# Altium schematic sheet Sheet1.SchDoc
size A1
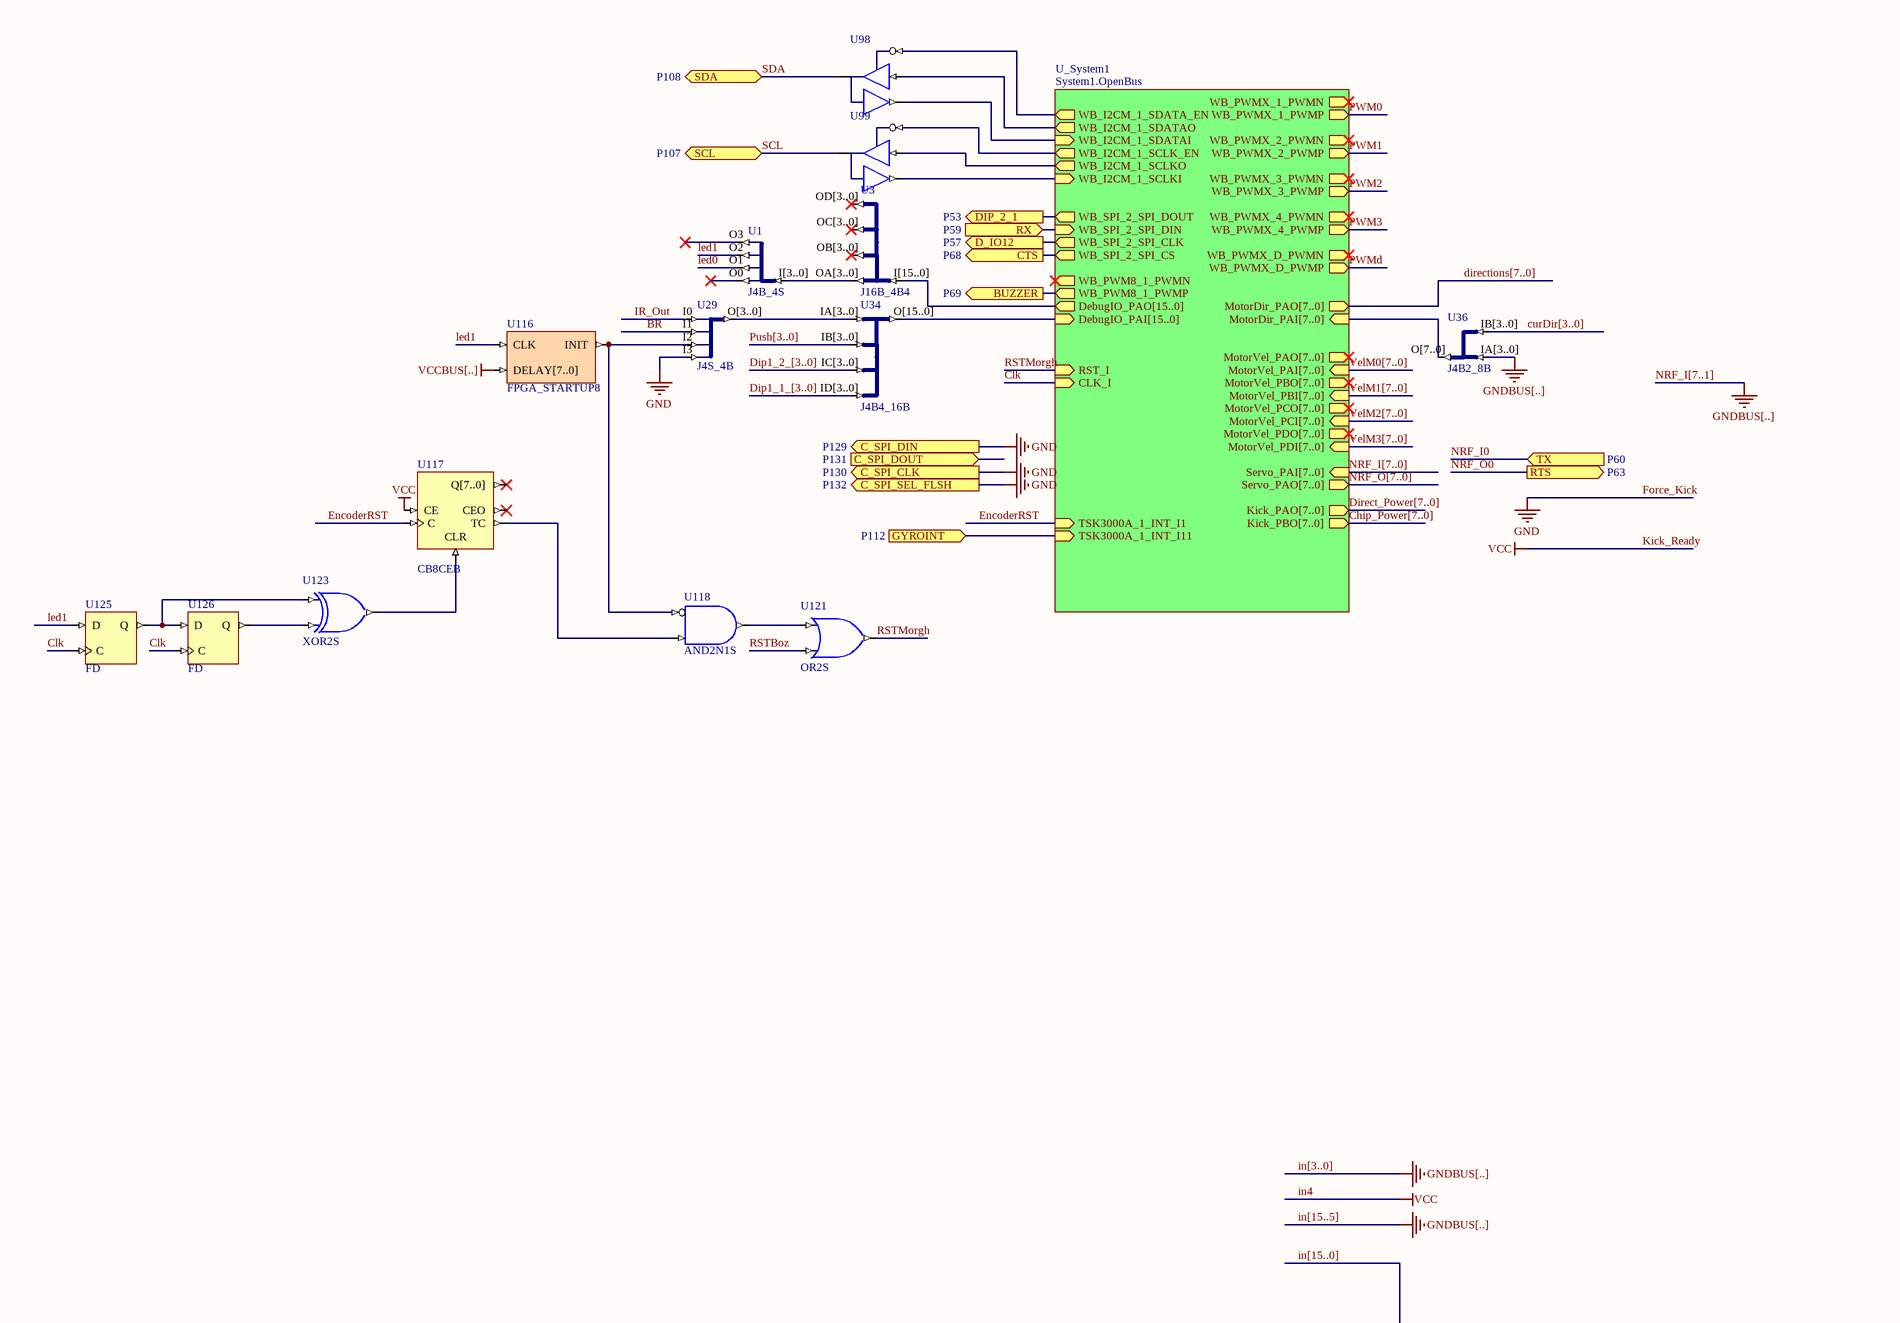
[diagram p0: Sheet1.SchDoc, top left]
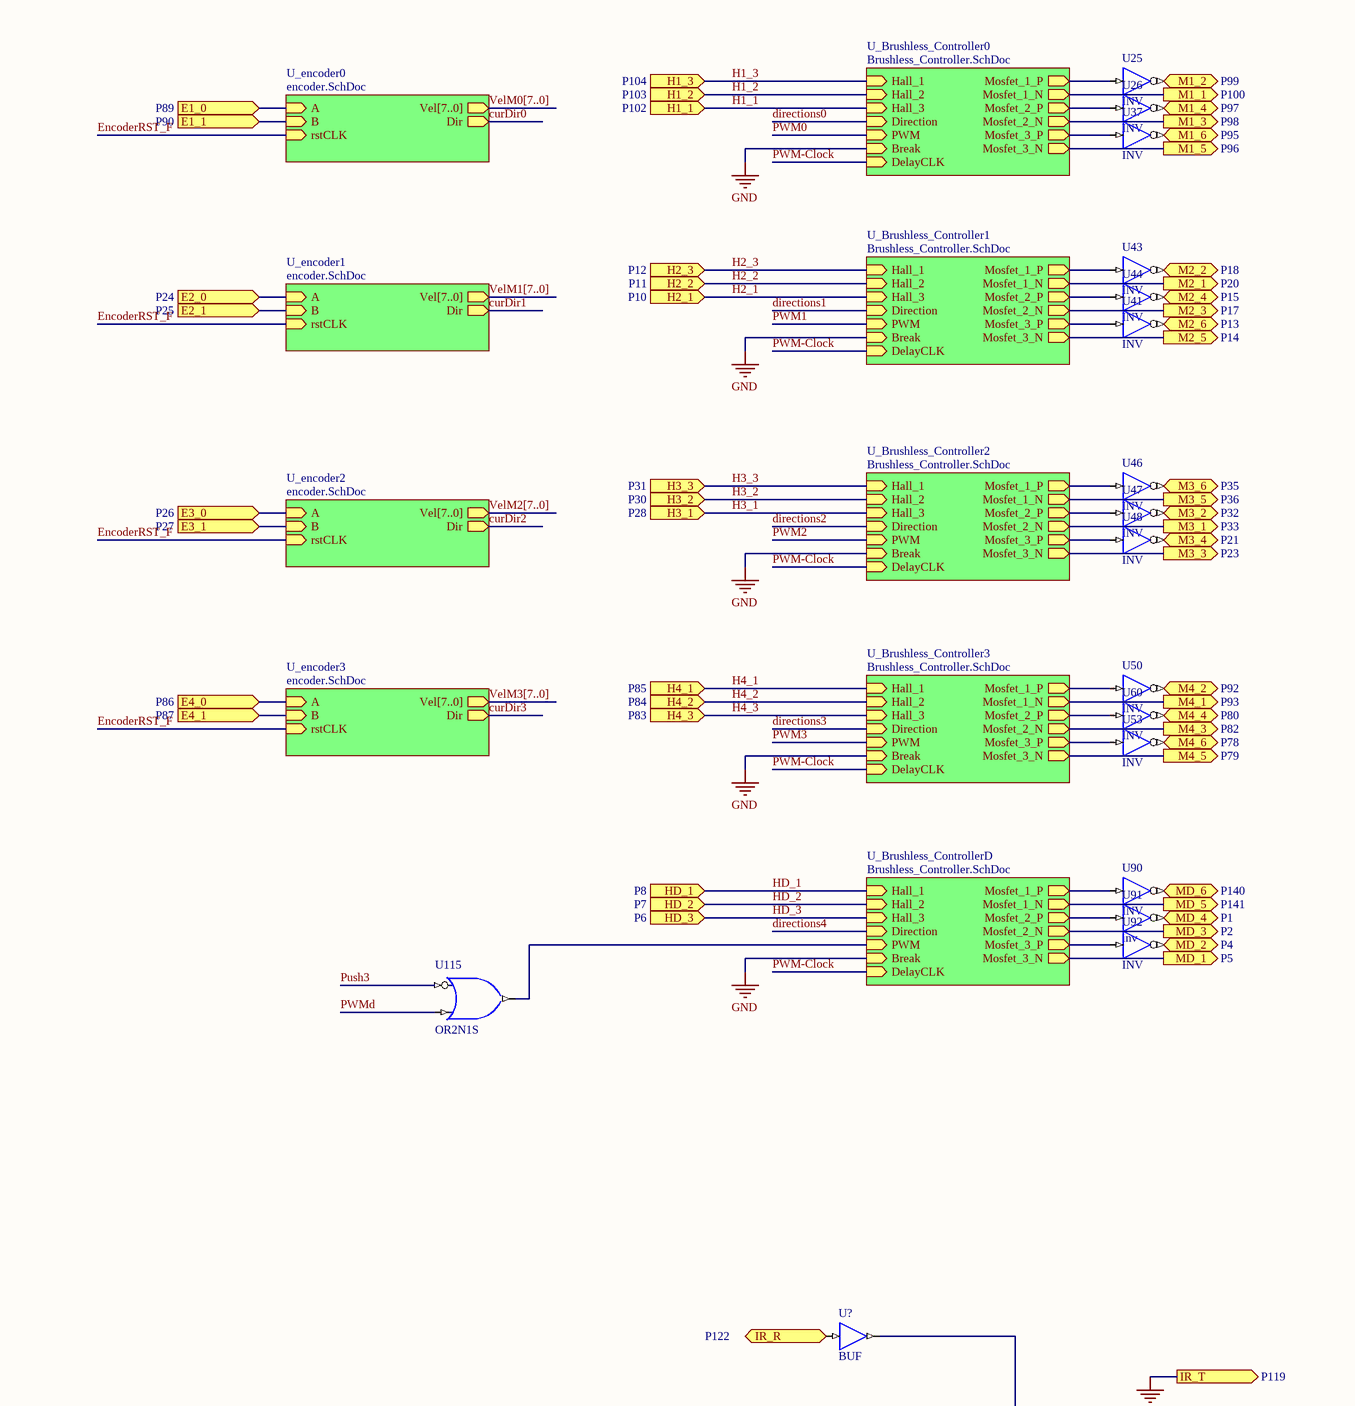
[diagram p1: Sheet1.SchDoc, top right]
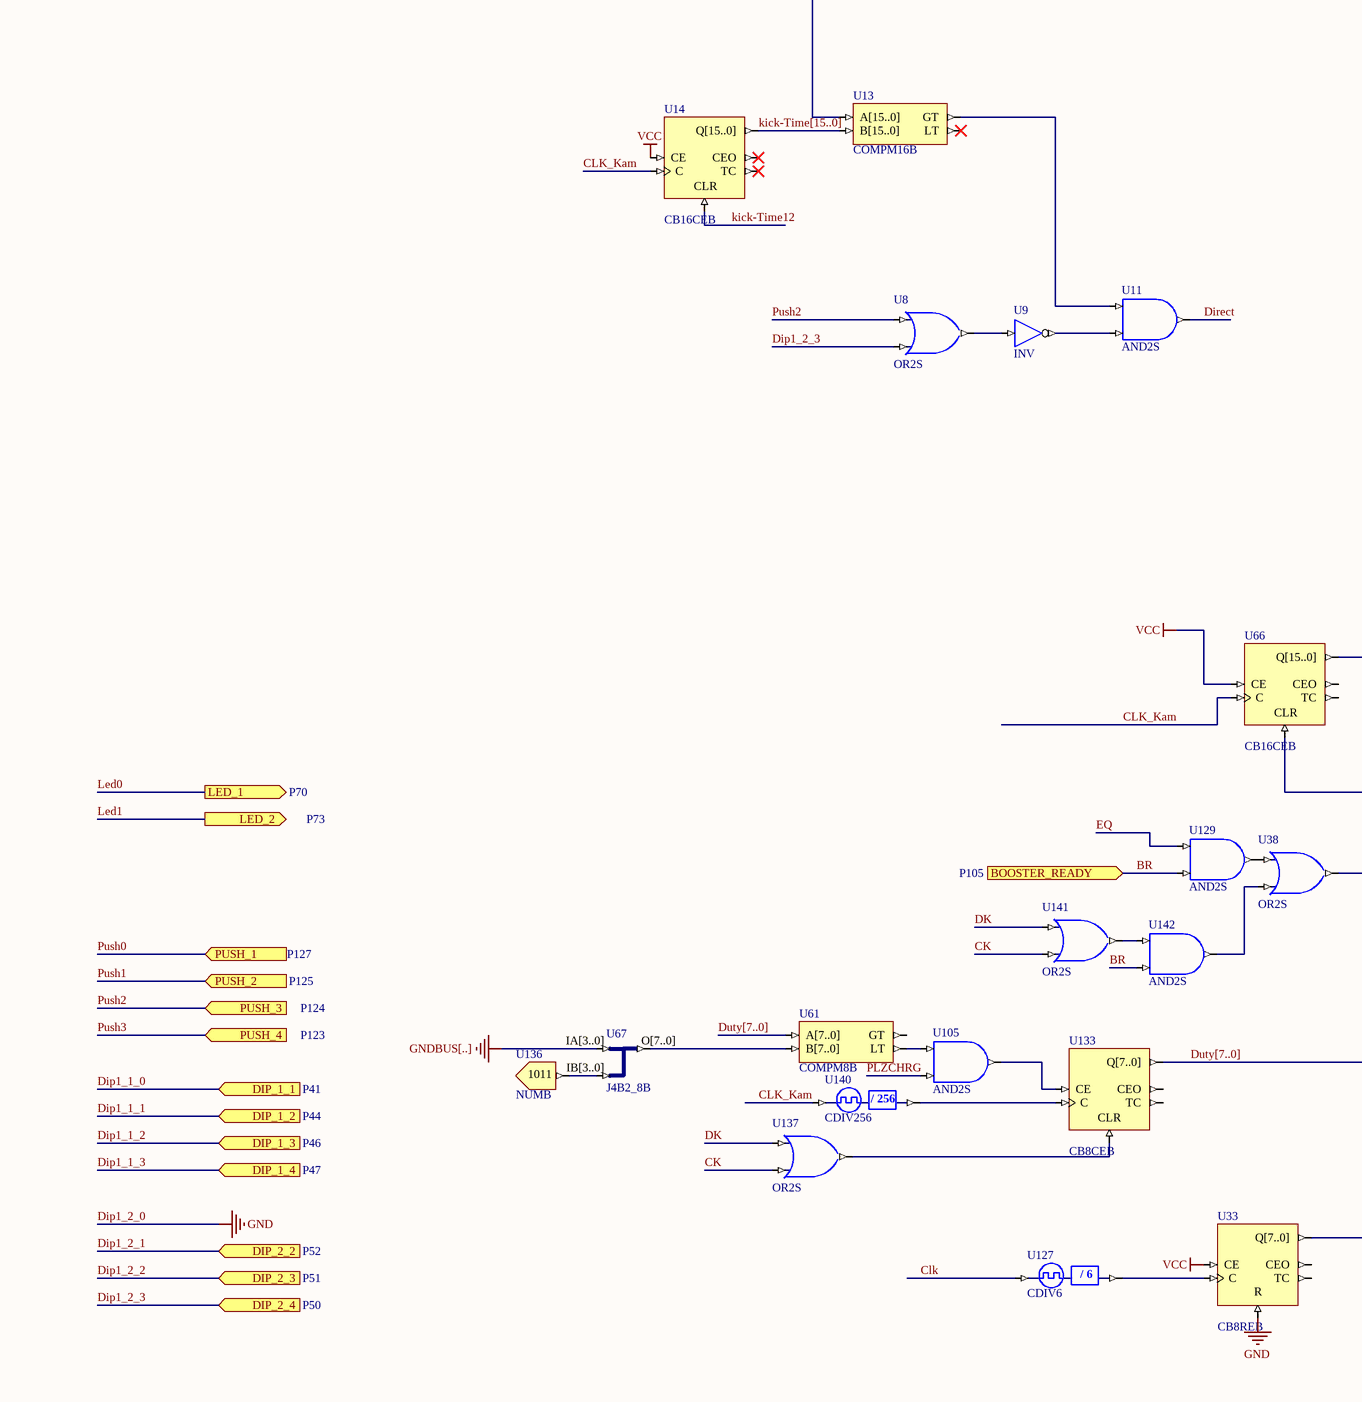
[diagram p2: Sheet1.SchDoc, bottom left]
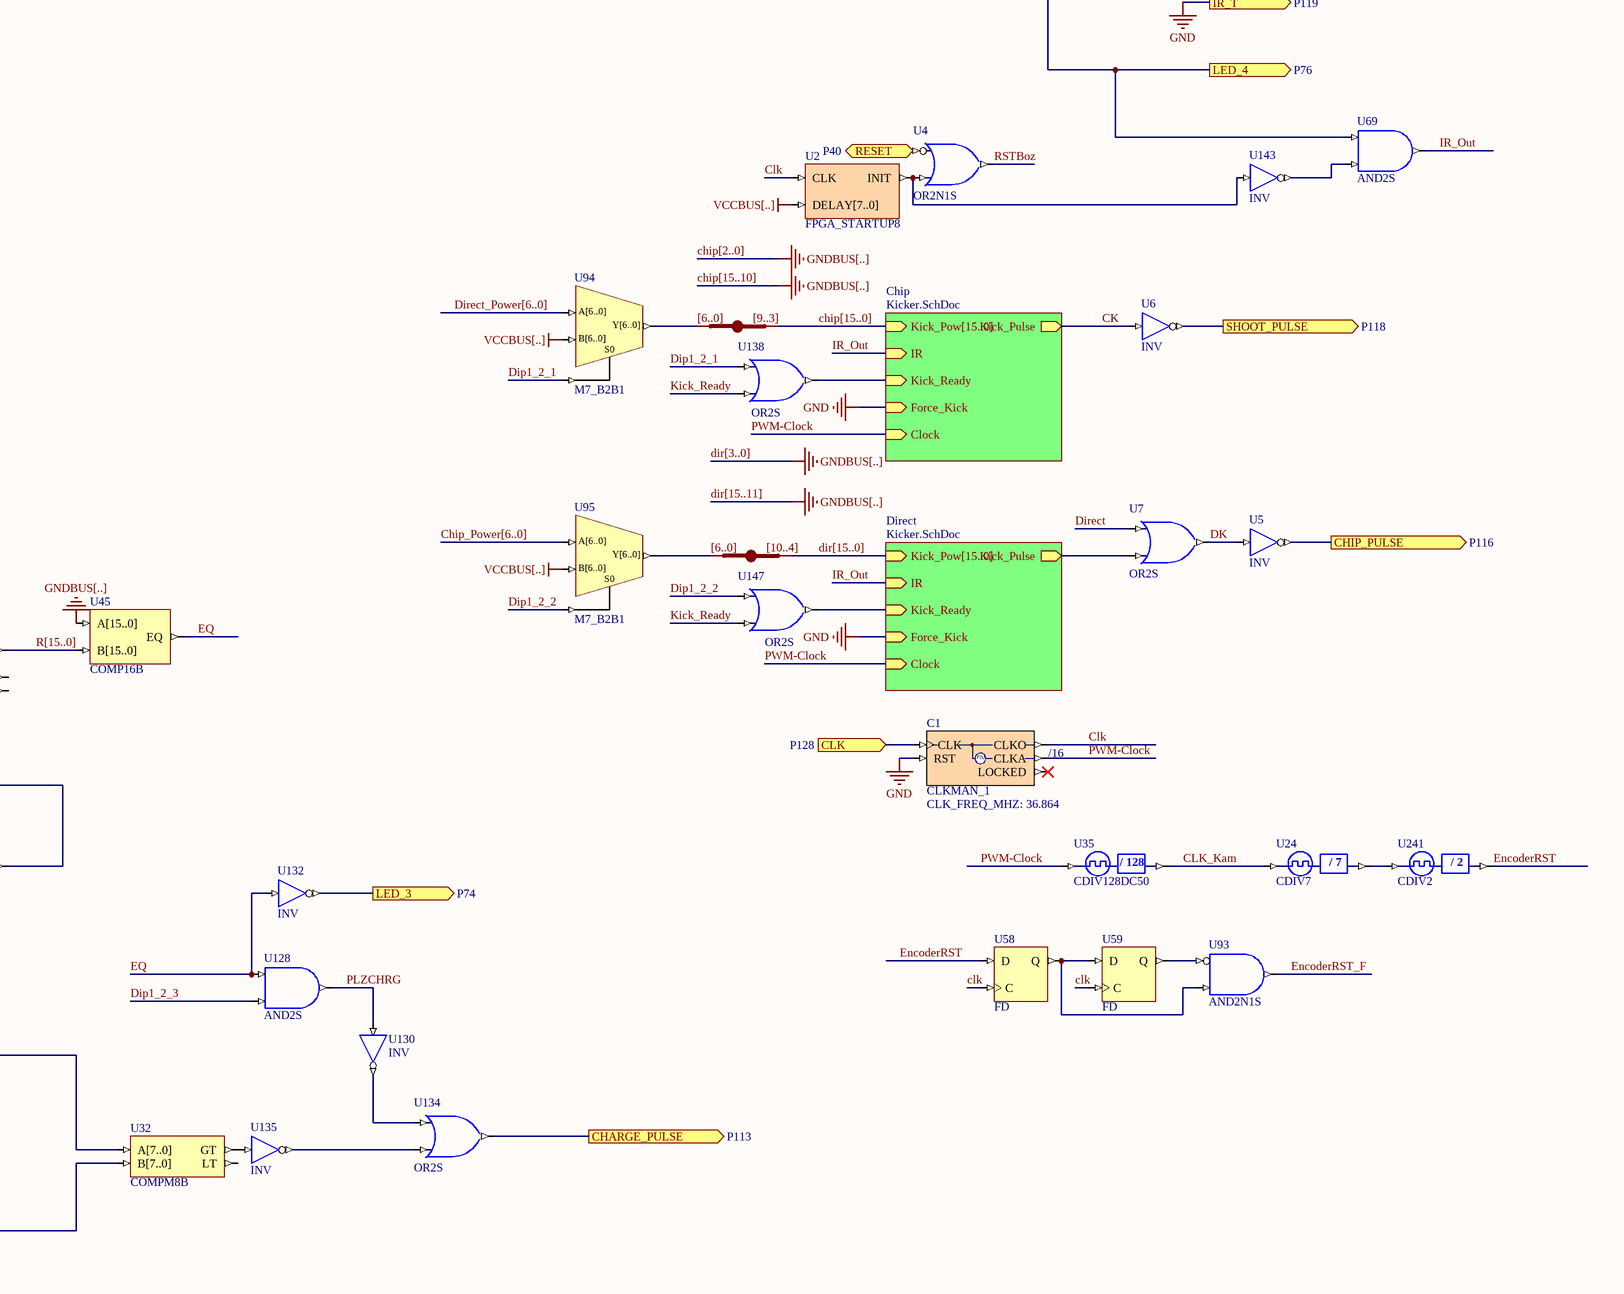
[diagram p3: Sheet1.SchDoc, bottom right]

## Parts
(Parts that share a designator on the sheet are numbered #1, #2 ... from top to bottom, then left to right.)
C1  CLKMAN_1  CLK_FREQ_MHZ: 36.864  ClkA_Operation: /16
JB_AUTO?#1  IndexA: [6..0]  IndexB: [9..3]  (hidden comment: JB)
JB_AUTO?#2  IndexA: [6..0]  IndexB: [10..4]  (hidden comment: JB)
U1  J4B_4S
U2  FPGA_STARTUP8
U3  J16B_4B4
U4  OR2N1S
U5  INV
U6  INV
U7  OR2S
U8  OR2S
U9  INV
U11  AND2S
U13  COMPM16B
U14  CB16CEB
U24  CDIV7
U25  INV
U26  INV
U29  J4S_4B
U32  COMPM8B
U33  CB8REB
U34  J4B4_16B
U35  CDIV128DC50
U36  J4B2_8B
U37  INV
U38  OR2S
U41  INV
U43  INV
U44  INV
U45  COMP16B
U46  INV
U47  INV
U48  INV
U50  INV
U53  INV
U58  FD
U59  FD
U60  INV
U61  COMPM8B
U66  CB16CEB
U67  J4B2_8B
U69  AND2S
U90  INV
U91  inv
U92  INV
U93  AND2N1S
U94  M7_B2B1
U95  M7_B2B1
U98  IOBUF  (value not drawn)
U99  IOBUF  (value not drawn)
U105  AND2S
U115  OR2N1S
U116  FPGA_STARTUP8
U117  CB8CEB
U118  AND2N1S
U121  OR2S
U123  XOR2S
U125  FD
U126  FD
U127  CDIV6
U128  AND2S
U129  AND2S
U130  INV
U132  INV
U133  CB8CEB
U134  OR2S
U135  INV
U136  NUMB
U137  OR2S
U138  OR2S
U140  CDIV256
U141  OR2S
U142  AND2S
U143  INV
U147  OR2S
U241  CDIV2
U?  BUF

## Sub-sheets
Chip = Kicker.SchDoc: Kick_Pow[15..0] (in), IR (in), Kick_Ready (in), Force_Kick (in), Clock (in), Kick_Pulse (out)
Direct = Kicker.SchDoc: Kick_Pow[15..0] (in), IR (in), Kick_Ready (in), Force_Kick (in), Clock (in), Kick_Pulse (out)
U_Brushless_Controller0 = Brushless_Controller.SchDoc: Hall_1 (in), Hall_2 (in), Hall_3 (in), Direction (in), PWM (in), Mosfet_1_P (out), Mosfet_1_N (out), Mosfet_2_P (out), Mosfet_2_N (out), Mosfet_3_P (out), Mosfet_3_N (out), Break (in), DelayCLK (in)
U_Brushless_Controller1 = Brushless_Controller.SchDoc: Hall_1 (in), Hall_2 (in), Hall_3 (in), Direction (in), PWM (in), Mosfet_1_P (out), Mosfet_1_N (out), Mosfet_2_P (out), Mosfet_2_N (out), Mosfet_3_P (out), Mosfet_3_N (out), Break (in), DelayCLK (in)
U_Brushless_Controller2 = Brushless_Controller.SchDoc: Hall_1 (in), Hall_2 (in), Hall_3 (in), Direction (in), PWM (in), Mosfet_1_P (out), Mosfet_1_N (out), Mosfet_2_P (out), Mosfet_2_N (out), Mosfet_3_P (out), Mosfet_3_N (out), Break (in), DelayCLK (in)
U_Brushless_Controller3 = Brushless_Controller.SchDoc: Hall_1 (in), Hall_2 (in), Hall_3 (in), Direction (in), PWM (in), Mosfet_1_P (out), Mosfet_1_N (out), Mosfet_2_P (out), Mosfet_2_N (out), Mosfet_3_P (out), Mosfet_3_N (out), Break (in), DelayCLK (in)
U_Brushless_ControllerD = Brushless_Controller.SchDoc: Hall_1 (in), Hall_2 (in), Hall_3 (in), Direction (in), PWM (in), Mosfet_1_P (out), Mosfet_1_N (out), Mosfet_2_P (out), Mosfet_2_N (out), Mosfet_3_P (out), Mosfet_3_N (out), Break (in), DelayCLK (in)
U_encoder0 = encoder.SchDoc: A (in), B (in), Vel[7..0] (out), Dir (out), rstCLK (in)
U_encoder1 = encoder.SchDoc: A (in), B (in), Vel[7..0] (out), Dir (out), rstCLK (in)
U_encoder2 = encoder.SchDoc: A (in), B (in), Vel[7..0] (out), Dir (out), rstCLK (in)
U_encoder3 = encoder.SchDoc: A (in), B (in), Vel[7..0] (out), Dir (out), rstCLK (in)
U_System1 = System1.OpenBus: MotorVel_PAO[7..0] (out), MotorVel_PAI[7..0] (in), MotorVel_PBO[7..0] (out), MotorVel_PBI[7..0] (in), MotorVel_PCO[7..0] (out), MotorVel_PCI[7..0] (in), MotorVel_PDO[7..0] (out), MotorVel_PDI[7..0] (in), WB_PWMX_1_PWMN (out), WB_PWMX_1_PWMP (out), WB_PWMX_2_PWMN (out), WB_PWMX_2_PWMP (out), WB_PWMX_3_PWMN (out), WB_PWMX_3_PWMP (out), WB_PWMX_4_PWMN (out), WB_PWMX_4_PWMP (out), DebugIO_PAO[15..0] (out), RST_I (in), CLK_I (in), DebugIO_PAI[15..0] (in), Kick_PAO[7..0] (out), Kick_PBO[7..0] (out), MotorDir_PAO[7..0] (out), Servo_PAO[7..0] (out), MotorDir_PAI[7..0] (in), WB_PWMX_D_PWMN (out), WB_PWMX_D_PWMP (out), TSK3000A_1_INT_I1 (in), WB_I2CM_1_SDATA_EN (out), WB_I2CM_1_SDATAO (out), WB_I2CM_1_SDATAI (in), WB_I2CM_1_SCLK_EN (out), WB_I2CM_1_SCLKO (out), WB_I2CM_1_SCLKI (in), TSK3000A_1_INT_I11 (in), WB_SPI_2_SPI_DOUT (out), WB_SPI_2_SPI_DIN (in), WB_SPI_2_SPI_CLK (out), WB_SPI_2_SPI_CS (out), Servo_PAI[7..0] (in), WB_PWM8_1_PWMN (out), WB_PWM8_1_PWMP (out)

## Ports
BOOSTER_READY (in, see P105), BUZZER (out, see P69), C_SPI_CLK (out, see P130), C_SPI_DIN (out, see P129), C_SPI_DOUT (in, see P131), C_SPI_SEL_FLSH (out, see P132), CHARGE_PULSE (out, see P113), CHIP_PULSE (out, see P116), CLK (in, see P128), CTS (out, see P68), D_IO12 (out, see P57), DIP_1_1 (in, see P41), DIP_1_2 (in, see P44), DIP_1_3 (in, see P46), DIP_1_4 (in, see P47), DIP_2_1 (out, see P53), DIP_2_2 (in, see P52), DIP_2_3 (in, see P51), DIP_2_4 (in, see P50), E1_0 (in, see P89), E1_1 (in, see P90), E2_0 (in, see P24), E2_1 (in, see P25), E3_0 (in, see P26), E3_1 (in, see P27), E4_0 (in, see P86), E4_1 (in, see P87), GYROINT (in, see P112), H1_1 (in, see P102), H1_2 (in, see P103), H1_3 (in, see P104), H2_1 (in, see P10), H2_2 (in, see P11), H2_3 (in, see P12), H3_1 (in, see P28), H3_2 (in, see P30), H3_3 (in, see P31), H4_1 (in, see P85), H4_2 (in, see P84), H4_3 (in, see P83), HD_1 (in, see P8), HD_2 (in, see P7), HD_3 (in, see P6), IR_R (in, see P122), IR_T (out, see P119), LED_1 (out, see P70), LED_2 (out, see P73), LED_3 (out, see P74), LED_4 (out, see P76), M1_1 (out, see P100), M1_2 (out, see P99), M1_3 (out, see P98), M1_4 (out, see P97), M1_5 (out, see P96), M1_6 (out, see P95), M2_1 (out, see P20), M2_2 (out, see P18), M2_3 (out, see P17), M2_4 (out, see P15), M2_5 (out, see P14), M2_6 (out, see P13), M3_1 (out, see P33), M3_2 (out, see P32), M3_3 (out, see P23), M3_4 (out, see P21), M3_5 (out, see P36), M3_6 (out, see P35), M4_1 (out, see P93), M4_2 (out, see P92), M4_3 (out, see P82), M4_4 (out, see P80), M4_5 (out, see P79), M4_6 (out, see P78), MD_1 (out, see P5), MD_2 (out, see P4), MD_3 (out, see P2), MD_4 (out, see P1), MD_5 (out, see P141), MD_6 (out, see P140), PUSH_1 (in, see P127), PUSH_2 (in, see P125), PUSH_3 (in, see P124), PUSH_4 (in, see P123), RESET (in, see P40), RTS (out, see P63), RX (in, see P59), SCL (bidir, see P107), SDA (bidir, see P108), SHOOT_PULSE (out, see P118), TX (in, see P60)

## Nets
chip[15..10]: U36.IA[3..0] U45.A[15..0] U67.IA[3..0]  [also labelled chip[2..0], dir[15..11], dir[3..0], GNDBUS[..], in[15..5], in[3..0], NRF_I[7..1]]
Dip1_2_0: C1.RST U29.I3 U33.R ; port IR_T, port C_SPI_DIN, port C_SPI_CLK, port C_SPI_SEL_FLSH, sheet U_Brushless_Controller0/Break, sheet U_Brushless_Controller1/Break, sheet U_Brushless_Controller2/Break, sheet U_Brushless_Controller3/Break, sheet U_Brushless_ControllerD/Break, sheet Chip/Force_Kick, sheet Direct/Force_Kick  [also labelled Force_Kick, GND]
in4: U14.CE U33.CE U66.CE U117.CE U138.I1 U147.I1  [also labelled Kick_Ready, VCC]
VCCBUS[..]: U2.DELAY[7..0] U94.B[6..0] U95.B[6..0] U116.DELAY[7..0]
BR: U29.I1 U129.I1 U142.I1 ; port BOOSTER_READY
BUZZER: port BUZZER, sheet U_System1/WB_PWM8_1_PWMP
CHARGE_PULSE: U134.O ; port CHARGE_PULSE
chip[15..0]: JB_AUTO?#1.B[0..0] ; sheet Chip/Kick_Pow[15..0]
Chip_Power[6..0]: U95.A[6..0]
CHIP_PULSE: U5.O ; port CHIP_PULSE
CK: U6.I U137.I1 U141.I1 ; sheet Chip/Kick_Pulse
Clk: C1.CLKO U2.CLK U58.C U59.C U125.C U126.C U127.CLKIN ; sheet U_System1/CLK_I
CLK: C1.CLK ; port CLK  [a separate net that carries the same name]
CLK_Kam: U14.C U24.CLKIN U35.CLKDV U66.C U140.CLKIN
CTS: port CTS, sheet U_System1/WB_SPI_2_SPI_CS
curDir0: sheet U_encoder0/Dir
curDir1: sheet U_encoder1/Dir
curDir2: sheet U_encoder2/Dir
curDir3: sheet U_encoder3/Dir
curDir[3..0]: U36.IB[3..0]
D_IO12: port D_IO12, sheet U_System1/WB_SPI_2_SPI_CLK
Dip1_1_0: port DIP_1_1
Dip1_1_1: port DIP_1_2
Dip1_1_2: port DIP_1_3
Dip1_1_3: port DIP_1_4
Dip1_1_[3..0]: U34.ID[3..0]
Dip1_2_1: U94.S0 U138.I0 ; port DIP_2_2
Dip1_2_2: U95.S0 U147.I0 ; port DIP_2_3
Dip1_2_3: U8.I1 U128.I1 ; port DIP_2_4
Dip1_2_[3..0]: U34.IC[3..0]
DIP_2_1: port DIP_2_1, sheet U_System1/WB_SPI_2_SPI_DOUT
dir[15..0]: JB_AUTO?#2.B[0..0] ; sheet Direct/Kick_Pow[15..0]
Direct: U7.I0 U11.O
Direct_Power[6..0]: U94.A[6..0]
directions0: sheet U_Brushless_Controller0/Direction
directions1: sheet U_Brushless_Controller1/Direction
directions2: sheet U_Brushless_Controller2/Direction
directions3: sheet U_Brushless_Controller3/Direction
directions4: sheet U_Brushless_ControllerD/Direction
DK: U5.I U7.O U137.I0 U141.I0
Duty[7..0]: U32.A[7..0] U61.A[7..0] U133.Q[7..0]
E1_0: port E1_0, sheet U_encoder0/A
E1_1: port E1_1, sheet U_encoder0/B
E2_0: port E2_0, sheet U_encoder1/A
E2_1: port E2_1, sheet U_encoder1/B
E3_0: port E3_0, sheet U_encoder2/A
E3_1: port E3_1, sheet U_encoder2/B
E4_0: port E4_0, sheet U_encoder3/A
E4_1: port E4_1, sheet U_encoder3/B
EncoderRST: U58.D U117.C U241.CLKDV ; sheet U_System1/TSK3000A_1_INT_I1
EncoderRST_F: U93.O ; sheet U_encoder2/rstCLK, sheet U_encoder1/rstCLK, sheet U_encoder0/rstCLK, sheet U_encoder3/rstCLK
EQ: U45.EQ U128.I0 U129.I0 U132.I
GYROINT: port GYROINT, sheet U_System1/TSK3000A_1_INT_I11
H1_1: port H1_1, sheet U_Brushless_Controller0/Hall_3
H1_2: port H1_2, sheet U_Brushless_Controller0/Hall_2
H1_3: port H1_3, sheet U_Brushless_Controller0/Hall_1
H2_1: port H2_1, sheet U_Brushless_Controller1/Hall_3
H2_2: port H2_2, sheet U_Brushless_Controller1/Hall_2
H2_3: port H2_3, sheet U_Brushless_Controller1/Hall_1
H3_1: port H3_1, sheet U_Brushless_Controller2/Hall_3
H3_2: port H3_2, sheet U_Brushless_Controller2/Hall_2
H3_3: port H3_3, sheet U_Brushless_Controller2/Hall_1
H4_1: port H4_1, sheet U_Brushless_Controller3/Hall_1
H4_2: port H4_2, sheet U_Brushless_Controller3/Hall_2
H4_3: port H4_3, sheet U_Brushless_Controller3/Hall_3
HD_1: port HD_1, sheet U_Brushless_ControllerD/Hall_1
HD_2: port HD_2, sheet U_Brushless_ControllerD/Hall_2
HD_3: port HD_3, sheet U_Brushless_ControllerD/Hall_3
in[15..0]: U13.A[15..0]
IR_Out: U29.I0 U69.O ; sheet Chip/IR, sheet Direct/IR
IR_R: U?.I ; port IR_R
kick-Time12: U14.CLR
kick-Time[15..0]: U13.B[15..0] U14.Q[15..0]
Led0: U1.O1 ; port LED_1
Led1: U1.O2 U116.CLK U125.D ; port LED_2
LED_3: U132.O ; port LED_3
LED_4: U69.I0 U?.O ; port LED_4
M1_1: port M1_1, sheet U_Brushless_Controller0/Mosfet_1_N
M1_2: U25.O ; port M1_2
M1_3: port M1_3, sheet U_Brushless_Controller0/Mosfet_2_N
M1_4: U26.O ; port M1_4
M1_5: port M1_5, sheet U_Brushless_Controller0/Mosfet_3_N
M1_6: U37.O ; port M1_6
M2_1: port M2_1, sheet U_Brushless_Controller1/Mosfet_1_N
M2_2: U43.O ; port M2_2
M2_3: port M2_3, sheet U_Brushless_Controller1/Mosfet_2_N
M2_4: U44.O ; port M2_4
M2_5: port M2_5, sheet U_Brushless_Controller1/Mosfet_3_N
M2_6: U41.O ; port M2_6
M3_1: port M3_1, sheet U_Brushless_Controller2/Mosfet_2_N
M3_2: U47.O ; port M3_2
M3_3: port M3_3, sheet U_Brushless_Controller2/Mosfet_3_N
M3_4: U48.O ; port M3_4
M3_5: port M3_5, sheet U_Brushless_Controller2/Mosfet_1_N
M3_6: U46.O ; port M3_6
M4_1: port M4_1, sheet U_Brushless_Controller3/Mosfet_1_N
M4_2: U50.O ; port M4_2
M4_3: port M4_3, sheet U_Brushless_Controller3/Mosfet_2_N
M4_4: U60.O ; port M4_4
M4_5: port M4_5, sheet U_Brushless_Controller3/Mosfet_3_N
M4_6: U53.O ; port M4_6
MD_1: port MD_1, sheet U_Brushless_ControllerD/Mosfet_3_N
MD_2: U92.O ; port MD_2
MD_3: port MD_3, sheet U_Brushless_ControllerD/Mosfet_2_N
MD_4: U91.O ; port MD_4
MD_5: port MD_5, sheet U_Brushless_ControllerD/Mosfet_1_N
MD_6: U90.O ; port MD_6
NRF_I0: port TX
NRF_O0: port RTS
PLZCHRG: U105.I1 U128.O U130.I
Push0: port PUSH_1
Push1: port PUSH_2
Push2: U8.I0 ; port PUSH_3
Push3: U115.I0 ; port PUSH_4
Push[3..0]: U34.IB[3..0]
PWM0: sheet U_System1/WB_PWMX_1_PWMP, sheet U_Brushless_Controller0/PWM
PWM1: sheet U_System1/WB_PWMX_2_PWMP, sheet U_Brushless_Controller1/PWM
PWM2: sheet U_System1/WB_PWMX_3_PWMP, sheet U_Brushless_Controller2/PWM
PWM3: sheet U_System1/WB_PWMX_4_PWMP, sheet U_Brushless_Controller3/PWM
PWM-Clock: C1.CLKA U35.CLKIN ; sheet U_Brushless_Controller0/DelayCLK, sheet U_Brushless_Controller1/DelayCLK, sheet U_Brushless_Controller2/DelayCLK, sheet U_Brushless_Controller3/DelayCLK, sheet U_Brushless_ControllerD/DelayCLK, sheet Chip/Clock, sheet Direct/Clock
PWMd: U115.I1 ; sheet U_System1/WB_PWMX_D_PWMP
R[15..0]: U45.B[15..0] U66.Q[15..0]
RESET: U4.I0 ; port RESET
RSTBoz: U4.O U121.I1
RSTMorgh: U121.O ; sheet U_System1/RST_I
RX: port RX, sheet U_System1/WB_SPI_2_SPI_DIN
SCL: U99.IO ; port SCL
SDA: U98.IO ; port SDA
SHOOT_PULSE: U6.O ; port SHOOT_PULSE
NetJB_AUTO?#1_A[0..0]: JB_AUTO?#1.A[0..0] U94.Y[6..0]
NetJB_AUTO?#2_A[0..0]: JB_AUTO?#2.A[0..0] U95.Y[6..0]
NetU1_I[3..0]: U1.I[3..0] U3.OA[3..0]
NetU2_INIT: U2.INIT U4.I1 U143.I
NetU3_I[15..0]: U3.I[15..0] ; sheet U_System1/DebugIO_PAO[15..0]
NetU7_I1: U7.I1 ; sheet Direct/Kick_Pulse
NetU8_O: U8.O U9.I
NetU9_O: U9.O U11.I1
NetU11_I0: U11.I0 U13.GT
NetU24_CLKDV: U24.CLKDV U241.CLKIN
NetU25_I: U25.I ; sheet U_Brushless_Controller0/Mosfet_1_P
NetU26_I: U26.I ; sheet U_Brushless_Controller0/Mosfet_2_P
NetU29_I2: U29.I2 U116.INIT U118.I0
NetU29_O[3..0]: U29.O[3..0] U34.IA[3..0]
NetU32_B[7..0]: U32.B[7..0] U33.Q[7..0]
NetU32_GT: U32.GT U135.I
NetU33_C: U33.C U127.CLKDV
NetU34_O[15..0]: U34.O[15..0] ; sheet U_System1/DebugIO_PAI[15..0]
NetU36_O[7..0]: U36.O[7..0] ; sheet U_System1/MotorDir_PAI[7..0]
NetU37_I: U37.I ; sheet U_Brushless_Controller0/Mosfet_3_P
NetU38_I0: U38.I0 U129.O
NetU38_I1: U38.I1 U142.O
NetU38_O: U38.O U66.CLR
NetU41_I: U41.I ; sheet U_Brushless_Controller1/Mosfet_3_P
NetU43_I: U43.I ; sheet U_Brushless_Controller1/Mosfet_1_P
NetU44_I: U44.I ; sheet U_Brushless_Controller1/Mosfet_2_P
NetU46_I: U46.I ; sheet U_Brushless_Controller2/Mosfet_1_P
NetU47_I: U47.I ; sheet U_Brushless_Controller2/Mosfet_2_P
NetU48_I: U48.I ; sheet U_Brushless_Controller2/Mosfet_3_P
NetU50_I: U50.I ; sheet U_Brushless_Controller3/Mosfet_1_P
NetU53_I: U53.I ; sheet U_Brushless_Controller3/Mosfet_3_P
NetU58_Q: U58.Q U59.D U93.I1
NetU59_Q: U59.Q U93.I0
NetU60_I: U60.I ; sheet U_Brushless_Controller3/Mosfet_2_P
NetU61_B[7..0]: U61.B[7..0] U67.O[7..0]
NetU61_LT: U61.LT U105.I0
NetU67_IB[3..0]: U67.IB[3..0] U136.O[3..0]
NetU69_I1: U69.I1 U143.O
NetU90_I: U90.I ; sheet U_Brushless_ControllerD/Mosfet_1_P
NetU91_I: U91.I ; sheet U_Brushless_ControllerD/Mosfet_2_P
NetU92_I: U92.I ; sheet U_Brushless_ControllerD/Mosfet_3_P
NetU98_I: U98.I ; sheet U_System1/WB_I2CM_1_SDATAO
NetU98_O: U98.O ; sheet U_System1/WB_I2CM_1_SDATAI
NetU98_T: U98.T ; sheet U_System1/WB_I2CM_1_SDATA_EN
NetU99_I: U99.I ; sheet U_System1/WB_I2CM_1_SCLKO
NetU99_O: U99.O ; sheet U_System1/WB_I2CM_1_SCLKI
NetU99_T: U99.T ; sheet U_System1/WB_I2CM_1_SCLK_EN
NetU105_O: U105.O U133.CE
NetU115_O: U115.O ; sheet U_Brushless_ControllerD/PWM
NetU117_CLR: U117.CLR U123.O
NetU117_TC: U117.TC U118.I1
NetU118_O: U118.O U121.I0
NetU123_I0: U123.I0 U125.Q U126.D
NetU123_I1: U123.I1 U126.Q
NetU130_O: U130.O U134.I0
NetU133_C: U133.C U140.CLKDV
NetU133_CLR: U133.CLR U137.O
NetU134_I1: U134.I1 U135.O
NetU138_O: U138.O ; sheet Chip/Kick_Ready
NetU141_O: U141.O U142.I0
NetU147_O: U147.O ; sheet Direct/Kick_Ready

Not connected (* = marked no-connect by the designer): C1 LOCKED*; U1 O0* O3*; U3 OB[3..0]* OC[3..0]* OD[3..0]*; U13 LT*; U14 CEO* TC*; U32 LT; U33 CEO TC; U61 GT; U66 CEO TC; U117 CEO* Q[7..0]*; U133 CEO TC

## Buses and harness runs
bus chip[2..0]
bus chip[15..0] = sheet Chip/Kick_Pow[15..0]
bus chip[15..10]
bus Chip_Power[6..0]
bus Chip_Power[7..0] = sheet U_System1/Kick_PBO[7..0]
bus curDir[3..0]
bus Dip1_1_[3..0]
bus Dip1_2_[3..0]
bus dir[3..0]
bus dir[15..0] = sheet Direct/Kick_Pow[15..0]
bus dir[15..11]
bus Direct_Power[6..0]
bus Direct_Power[7..0] = sheet U_System1/Kick_PAO[7..0]
bus directions[7..0] = sheet U_System1/MotorDir_PAO[7..0]
bus Duty[7..0]
bus in[3..0]
bus in[15..0]
bus in[15..5]
bus kick-Time[15..0]
bus NRF_I[7..0] = sheet U_System1/Servo_PAI[7..0]
bus NRF_I[7..1]
bus NRF_O[7..0] = sheet U_System1/Servo_PAO[7..0]
bus Push[3..0]
bus R[15..0]
bus VelM0[7..0] = sheet U_encoder0/Vel[7..0]
bus VelM0[7..0] = sheet U_System1/MotorVel_PAI[7..0]
bus VelM1[7..0] = sheet U_encoder1/Vel[7..0]
bus VelM1[7..0] = sheet U_System1/MotorVel_PBI[7..0]
bus VelM2[7..0] = sheet U_encoder2/Vel[7..0]
bus VelM2[7..0] = sheet U_System1/MotorVel_PCI[7..0]
bus VelM3[7..0] = sheet U_encoder3/Vel[7..0]
bus VelM3[7..0] = sheet U_System1/MotorVel_PDI[7..0]

## Notes on the sheet
- (in symbol CDIV2) / 2
- (in symbol CDIV6) / 6
- (in symbol CDIV7) / 7
- (in symbol CDIV128DC50) / 128
- (in symbol CDIV256) / 256
- (in symbol CLKMAN_1) F(x)
- (in symbol NUMB) 1011

## Library data of the parts
C1 = CLKMAN_1: Single Operational Output Clock Manager; Clk_Count: 1; Published: 5-Jul-2004; Publisher: Altium Limited; LastRevisionNo: 1.00.00; Nexus_Core: ClockManager; HelpURL: CR0118 FPGA Generic Library Guide.pdf#page=149; ComponentLink1URL: CR0128 FPGA Clock Manager Resource Usage.pdf#page=2; ComponentLink1Description: Core &Resource Usage; FunctionalClass: Clock Manager; PortSize: 1
JB_AUTO?#1 JB_AUTO?#2 = JB: System BUS Joiner; Published: 29-Jan-2004; Publisher: Altium Limited; LastRevisionNo: 1.00.00; HelpURL: CR0118 FPGA Generic Library Guide.pdf#page=297; FunctionalClass: Bus Joiner
U1 = J4B_4S: 4-Bit input bus to 4 Single pin outputs; FunctionalClass: Bus Joiner; PortSize: 4; ArchiveName: GENERIC; VHDLIB_SIM: GENERIC_LIB; Published: 29-Jan-2004; Publisher: Altium Limited; LastRevisionNo: 1.00.00; HelpURL: CR0118 FPGA Generic Library Guide.pdf#page=304; ComponentLink1URL: CR0126 FPGA Bus Joiner Resource Usage.pdf#page=11; ComponentLink1Description: Core &Resource Usage
U2 U116 = FPGA_STARTUP8: FPGA Startup With 8 Bit Delay; Published: 9-Dec-2004; Publisher: Altium Limited; HelpURL: CR0119 FPGA_STARTUPx Powerup Delay Unit.pdf; LastRevisionNo: 1.00.00; ComponentLink1Description: Core &Resource Usage; ComponentLink1URL: CR0139 FPGA Peripheral Resource Usage.pdf#page=11
U3 = J16B_4B4: 1 x 16-bit input bus to 4 x 4-Bit output bus; FunctionalClass: Bus Joiner; PortSize: 16; ArchiveName: GENERIC; VHDLIB_SIM: GENERIC_LIB; Published: 29-Jan-2004; Publisher: Altium Limited; LastRevisionNo: 1.00.00; HelpURL: CR0118 FPGA Generic Library Guide.pdf#page=298; ComponentLink1URL: CR0126 FPGA Bus Joiner Resource Usage.pdf#page=40; ComponentLink1Description: Core &Resource Usage
U4 U115 = OR2B1: 2-Input OR Gate with Active Low A Input, Single Pin Version; XilinxEquivalent: OR2B1; FunctionalClass: Logic Primitive; PortSize: 2; ArchiveName: GENERIC; VHDLIB_SIM: GENERIC_LIB; Published: 29-Jan-2004; Publisher: Altium Limited; LastRevisionNo: 1.00.00; HelpURL: CR0118 FPGA Generic Library Guide.pdf#page=410; ComponentLink1URL: CR0136 FPGA Logic Primitive Resource Usage.pdf#page=187; ComponentLink1Description: Core &Resource Usage; SubClass: OR; PortStyle: Single Pin Version
U5 U6 U9 U25 U26 U37 U41 U43 U44 U46-U48 U50 U53 U60 U90 U92 U130 U132 U135 U143 = INV: Inverter; FunctionalClass: Logic Primitive; ArchiveName: GENERIC; VHDLIB_SIM: GENERIC_LIB; Published: 29-Jan-2004; Publisher: Altium Limited; XilinxEquivalent: INV; LastRevisionNo: 1.00.00; HelpURL: CR0118 FPGA Generic Library Guide.pdf#page=291; ComponentLink1URL: CR0136 FPGA Logic Primitive Resource Usage.pdf#page=61; ComponentLink1Description: Core &Resource Usage; SubClass: INV
U7 U8 U38 U121 U134 U137 U138 U141 U147 = OR2: 2-Input OR Gate, Single Pin Version; XilinxEquivalent: OR2; FunctionalClass: Logic Primitive; PortSize: 2; ArchiveName: GENERIC; VHDLIB_SIM: GENERIC_LIB; Published: 29-Jan-2004; Publisher: Altium Limited; LastRevisionNo: 1.00.00; HelpURL: CR0118 FPGA Generic Library Guide.pdf#page=410; ComponentLink1URL: CR0136 FPGA Logic Primitive Resource Usage.pdf#page=190; ComponentLink1Description: Core &Resource Usage; SubClass: OR; PortStyle: Single Pin Version
U11 U69 U128 U129 U142 = AND2: 2-Input AND Gate, Single Pin Version; XilinxEquivalent: AND2; FunctionalClass: Logic Primitive; PortSize: 2; ArchiveName: GENERIC; VHDLIB_SIM: GENERIC_LIB; Published: 29-Jan-2004; Publisher: Altium Limited; LastRevisionNo: 1.00.00; HelpURL: CR0118 FPGA Generic Library Guide.pdf#page=114; ComponentLink1URL: CR0136 FPGA Logic Primitive Resource Usage.pdf#page=13; ComponentLink1Description: Core &Resource Usage; SubClass: AND; PortStyle: Single Pin Version
U13 = COMPM16B: 16-Bit Magnitude Comparator, Bus Version; SubClass: COMPM; PortSize: 16; ArchiveName: GENERIC; VHDLIB_SIM: GENERIC_LIB; Published: 29-Jan-2004; Publisher: Altium Limited; XilinxEquivalent: COMPM16; LastRevisionNo: 1.00.00; HelpURL: CR0118 FPGA Generic Library Guide.pdf#page=153; ComponentLink1URL: CR0129 FPGA Comparator Resource Usage.pdf#page=45; ComponentLink1Description: Core &Resource Usage; FunctionalClass: Comparator; PortStyle: Bus Version
U14 U66 = CB16CEB: 16-Bit Cascadable Binary Counters with Clock Enable and Asynchronous Clear, Bus Version; XilinxEquivalent: CB16CE; ClockTrigger: Rising; Enable: High; PortSize: 16; ArchiveName: GENERIC; VHDLIB_SIM: GENERIC_LIB; Published: 29-Jan-2004; Publisher: Altium Limited; LastRevisionNo: 1.00.00; HelpURL: CR0118 FPGA Generic Library Guide.pdf#page=128; ComponentLink1URL: CR0130 FPGA Counter Resource Usage.pdf#page=33; ComponentLink1Description: Core &Resource Usage; FunctionalClass: Counter; SubClass: Binary; Reset: Asynchronous; PortType: Bus Version
U24 = CDIV7: Clock Divider by 7; DivisorRate: 7; ArchiveName: GENERIC; VHDLIB_SIM: GENERIC_LIB; Published: 29-Jan-2004; Publisher: Altium Limited; LastRevisionNo: 1.00.00; HelpURL: CR0118 FPGA Generic Library Guide.pdf#page=142; ComponentLink1URL: CR0127 FPGA Clock Divider Resource Usage.pdf#page=10; ComponentLink1Description: Core &Resource Usage; FunctionalClass: Clock Divider
U29 = J4S_4B: 4 Single pin inputs to single 4-Bit output bus; FunctionalClass: Bus Joiner; PortSize: 4; ArchiveName: GENERIC; VHDLIB_SIM: GENERIC_LIB; Published: 29-Jan-2004; Publisher: Altium Limited; LastRevisionNo: 1.00.00; HelpURL: CR0118 FPGA Generic Library Guide.pdf#page=306; ComponentLink1URL: CR0126 FPGA Bus Joiner Resource Usage.pdf#page=12; ComponentLink1Description: Core &Resource Usage
U32 U61 = COMPM8B: 8-Bit Magnitude Comparator, Bus Version; XilinxEquivalent: COMPM8; SubClass: COMPM; PortSize: 8; ArchiveName: GENERIC; VHDLIB_SIM: GENERIC_LIB; Published: 29-Jan-2004; Publisher: Altium Limited; LastRevisionNo: 1.00.00; HelpURL: CR0118 FPGA Generic Library Guide.pdf#page=153; ComponentLink1URL: CR0129 FPGA Comparator Resource Usage.pdf#page=37; ComponentLink1Description: Core &Resource Usage; FunctionalClass: Comparator; PortStyle: Bus Version
U33 = CB8REB: 8-Bit Cascadable Binary Counter with Clock Enable and Synchronous Reset, Bus Version; XilinxEquivalent: CB8RE; ClockTrigger: Rising; Enable: High; PortSize: 8; ArchiveName: GENERIC; VHDLIB_SIM: GENERIC_LIB; Published: 29-Jan-2004; Publisher: Altium Limited; LastRevisionNo: 1.00.00; HelpURL: CR0118 FPGA Generic Library Guide.pdf#page=134; ComponentLink1URL: CR0130 FPGA Counter Resource Usage.pdf#page=29; ComponentLink1Description: Core &Resource Usage; FunctionalClass: Counter; SubClass: Binary; Reset: Synchronous; PortType: Bus Version
U34 = J4B4_16B: 4 x 4-Bit input bus to 1 x 16-bit output bus; FunctionalClass: Bus Joiner; PortSize: 4; ArchiveName: GENERIC; VHDLIB_SIM: GENERIC_LIB; Published: 29-Jan-2004; Publisher: Altium Limited; LastRevisionNo: 1.00.00; HelpURL: CR0118 FPGA Generic Library Guide.pdf#page=302; ComponentLink1URL: CR0126 FPGA Bus Joiner Resource Usage.pdf#page=7; ComponentLink1Description: Core &Resource Usage
U35 = CDIV128DC50: Clock Divider by 128 with 50% Duty Cycle Output; DivisorRate: 128; DutyCycle: 50; ArchiveName: GENERIC; VHDLIB_SIM: GENERIC_LIB; Published: 29-Jan-2004; Publisher: Altium Limited; LastRevisionNo: 1.00.00; HelpURL: CR0118 FPGA Generic Library Guide.pdf#page=143; ComponentLink1URL: CR0127 FPGA Clock Divider Resource Usage.pdf#page=29; ComponentLink1Description: Core &Resource Usage; FunctionalClass: Clock Divider
U36 U67 = J4B2_8B: 2 x 4-Bit input bus to 1 x 8-bit output bus; FunctionalClass: Bus Joiner; PortSize: 4; ArchiveName: GENERIC; VHDLIB_SIM: GENERIC_LIB; Published: 29-Jan-2004; Publisher: Altium Limited; LastRevisionNo: 1.00.00; HelpURL: CR0118 FPGA Generic Library Guide.pdf#page=302; ComponentLink1URL: CR0126 FPGA Bus Joiner Resource Usage.pdf#page=6; ComponentLink1Description: Core &Resource Usage
U45 = COMP16B: 16-Bit Identity Comparator, Bus Version; XilinxEquivalent: COMP16; SubClass: COMP; PortSize: 16; ArchiveName: GENERIC; VHDLIB_SIM: GENERIC_LIB; Published: 29-Jan-2004; Publisher: Altium Limited; LastRevisionNo: 1.00.00; HelpURL: CR0118 FPGA Generic Library Guide.pdf#page=151; ComponentLink1URL: CR0129 FPGA Comparator Resource Usage.pdf#page=22; ComponentLink1Description: Core &Resource Usage; FunctionalClass: Comparator; PortStyle: Bus Version
U58 U59 U125 U126 = FD: D-Type Flip-Flop; ClockTrigger: Rising; ArchiveName: GENERIC; VHDLIB_SIM: GENERIC_LIB; Published: 29-Jan-2004; Publisher: Altium Limited; XilinxEquivalent: FD; LastRevisionNo: 1.00.00; HelpURL: CR0118 FPGA Generic Library Guide.pdf#page=170; ComponentLink1URL: CR0133 FPGA Flip Flop Resource Usage.pdf#page=4; ComponentLink1Description: Core &Resource Usage; FunctionalClass: Flip-Flop; SubClass: FD
U91 = inv: Inverter; FunctionalClass: Logic Primitive; ArchiveName: GENERIC; VHDLIB_SIM: GENERIC_LIB; Published: 29-Jan-2004; Publisher: Altium Limited; XilinxEquivalent: INV; LastRevisionNo: 1.00.00; HelpURL: CR0118 FPGA Generic Library Guide.pdf#page=291; ComponentLink1URL: CR0136 FPGA Logic Primitive Resource Usage.pdf#page=61; ComponentLink1Description: Core &Resource Usage; SubClass: INV
U93 U118 = AND2B1: 2-Input AND Gate with Active Low A Input, Single Pin Version; XilinxEquivalent: AND2B1; FunctionalClass: Logic Primitive; PortSize: 2; ArchiveName: GENERIC; VHDLIB_SIM: GENERIC_LIB; Published: 29-Jan-2004; Publisher: Altium Limited; LastRevisionNo: 1.00.00; HelpURL: CR0118 FPGA Generic Library Guide.pdf#page=114; ComponentLink1URL: CR0136 FPGA Logic Primitive Resource Usage.pdf#page=10; ComponentLink1Description: Core &Resource Usage; SubClass: AND; PortStyle: Single Pin Version
U94 U95 = M7_B2B1: 2x7-Bit Bus to 1x7-Bit Bus Multiplexer; SubClass: BnB1; PortSize: 7; PortStyle: Bus Version; ArchiveName: GENERIC; VHDLIB_SIM: GENERIC_LIB; Published: 29-Jan-2004; Publisher: Altium Limited; LastRevisionNo: 1.00.00; HelpURL: CR0118 FPGA Generic Library Guide.pdf#page=366; ComponentLink1URL: CR0137 FPGA Multiplexer Resource Usage.pdf#page=270; ComponentLink1Description: Core &Resource Usage; FunctionalClass: Multiplexer
U98 U99 = IOBUF: Input/Output Buffer; Enable: Low; Control: Common Control T; ArchiveName: GENERIC; VHDLIB_SIM: GENERIC_LIB; Published: 29-Jan-2004; Publisher: Altium Limited; XilinxEquivalent: IOBUF; LastRevisionNo: 1.00.00; HelpURL: CR0118 FPGA Generic Library Guide.pdf#page=293; ComponentLink1URL: CR0125 FPGA Buffer Resource Usage.pdf#page=78; ComponentLink1Description: Core &Resource Usage; FunctionalClass: Buffer; SubClass: IOBUF
U105 = and2: 2-Input AND Gate, Single Pin Version; XilinxEquivalent: AND2; FunctionalClass: Logic Primitive; PortSize: 2; ArchiveName: GENERIC; VHDLIB_SIM: GENERIC_LIB; Published: 29-Jan-2004; Publisher: Altium Limited; LastRevisionNo: 1.00.00; HelpURL: CR0118 FPGA Generic Library Guide.pdf#page=114; ComponentLink1URL: CR0136 FPGA Logic Primitive Resource Usage.pdf#page=13; ComponentLink1Description: Core &Resource Usage; SubClass: AND; PortStyle: Single Pin Version
U117 U133 = CB8CEB: 8-Bit Cascadable Binary Counters with Clock Enable and Asynchronous Clear, Bus Version; XilinxEquivalent: CB8CE; ClockTrigger: Rising; Enable: High; PortSize: 8; ArchiveName: GENERIC; VHDLIB_SIM: GENERIC_LIB; Published: 29-Jan-2004; Publisher: Altium Limited; LastRevisionNo: 1.00.00; HelpURL: CR0118 FPGA Generic Library Guide.pdf#page=128; ComponentLink1URL: CR0130 FPGA Counter Resource Usage.pdf#page=23; ComponentLink1Description: Core &Resource Usage; FunctionalClass: Counter; SubClass: Binary; Reset: Asynchronous; PortType: Bus Version
U123 = XOR2: 2-Input Exclusive-OR Gate, Single Pin Version; XilinxEquivalent: XOR2; FunctionalClass: Logic Primitive; SubClass: XOR; PortSize: 2; ArchiveName: GENERIC; VHDLIB_SIM: GENERIC_LIB; Published: 29-Jan-2004; Publisher: Altium Limited; LastRevisionNo: 1.00.00; HelpURL: CR0118 FPGA Generic Library Guide.pdf#page=448; ComponentLink1URL: CR0136 FPGA Logic Primitive Resource Usage.pdf#page=301; ComponentLink1Description: Core &Resource Usage; PortStyle: Single Pin Version
U127 = CDIV6: Clock Divider by 6; DivisorRate: 6; ArchiveName: GENERIC; VHDLIB_SIM: GENERIC_LIB; Published: 29-Jan-2004; Publisher: Altium Limited; LastRevisionNo: 1.00.00; HelpURL: CR0118 FPGA Generic Library Guide.pdf#page=142; ComponentLink1URL: CR0127 FPGA Clock Divider Resource Usage.pdf#page=8; ComponentLink1Description: Core &Resource Usage; FunctionalClass: Clock Divider
U136 = NUMB: Number Connector B; FunctionalClass: Numeric Connector; PortSize: 4; PortStyle: Bus Version; ArchiveName: GENERIC; VHDLIB_SIM: GENERIC_LIB; Published: 29-Jan-2004; Publisher: Altium Limited; LastRevisionNo: 1.00.00; HelpURL: CR0118 FPGA Generic Library Guide.pdf#page=409; ComponentLink1URL: CR0138 FPGA Numeric Connector Resource Usage.pdf#page=13; ComponentLink1Description: Core &Resource Usage; SubClass: B
U140 = CDIV256: Clock Divider by 256; DivisorRate: 256; ArchiveName: GENERIC; VHDLIB_SIM: GENERIC_LIB; Published: 29-Jan-2004; Publisher: Altium Limited; LastRevisionNo: 1.00.00; HelpURL: CR0118 FPGA Generic Library Guide.pdf#page=142; ComponentLink1URL: CR0127 FPGA Clock Divider Resource Usage.pdf#page=30; ComponentLink1Description: Core &Resource Usage; FunctionalClass: Clock Divider
U241 = CDIV2: Clock Divider by 2; DivisorRate: 2; ArchiveName: GENERIC; VHDLIB_SIM: GENERIC_LIB; Published: 29-Jan-2004; Publisher: Altium Limited; LastRevisionNo: 1.00.00; HelpURL: CR0118 FPGA Generic Library Guide.pdf#page=142; ComponentLink1URL: CR0127 FPGA Clock Divider Resource Usage.pdf#page=2; ComponentLink1Description: Core &Resource Usage; FunctionalClass: Clock Divider
U? = BUF: 1-bit General Purpose (Non-inverting) Buffer; ArchiveName: GENERIC; VHDLIB_SIM: GENERIC_LIB; Published: 29-Jan-2004; Publisher: Altium Limited; XilinxEquivalent: BUF; LastRevisionNo: 1.00.00; HelpURL: CR0118 FPGA Generic Library Guide.pdf#page=122; ComponentLink1URL: CR0125 FPGA Buffer Resource Usage.pdf#page=3; ComponentLink1Description: Core &Resource Usage; FunctionalClass: Buffer; SubClass: BUF